# Altium schematic sheet Sheet1.SchDoc
size A3; SheetNumber: 1; SheetTotal: 1
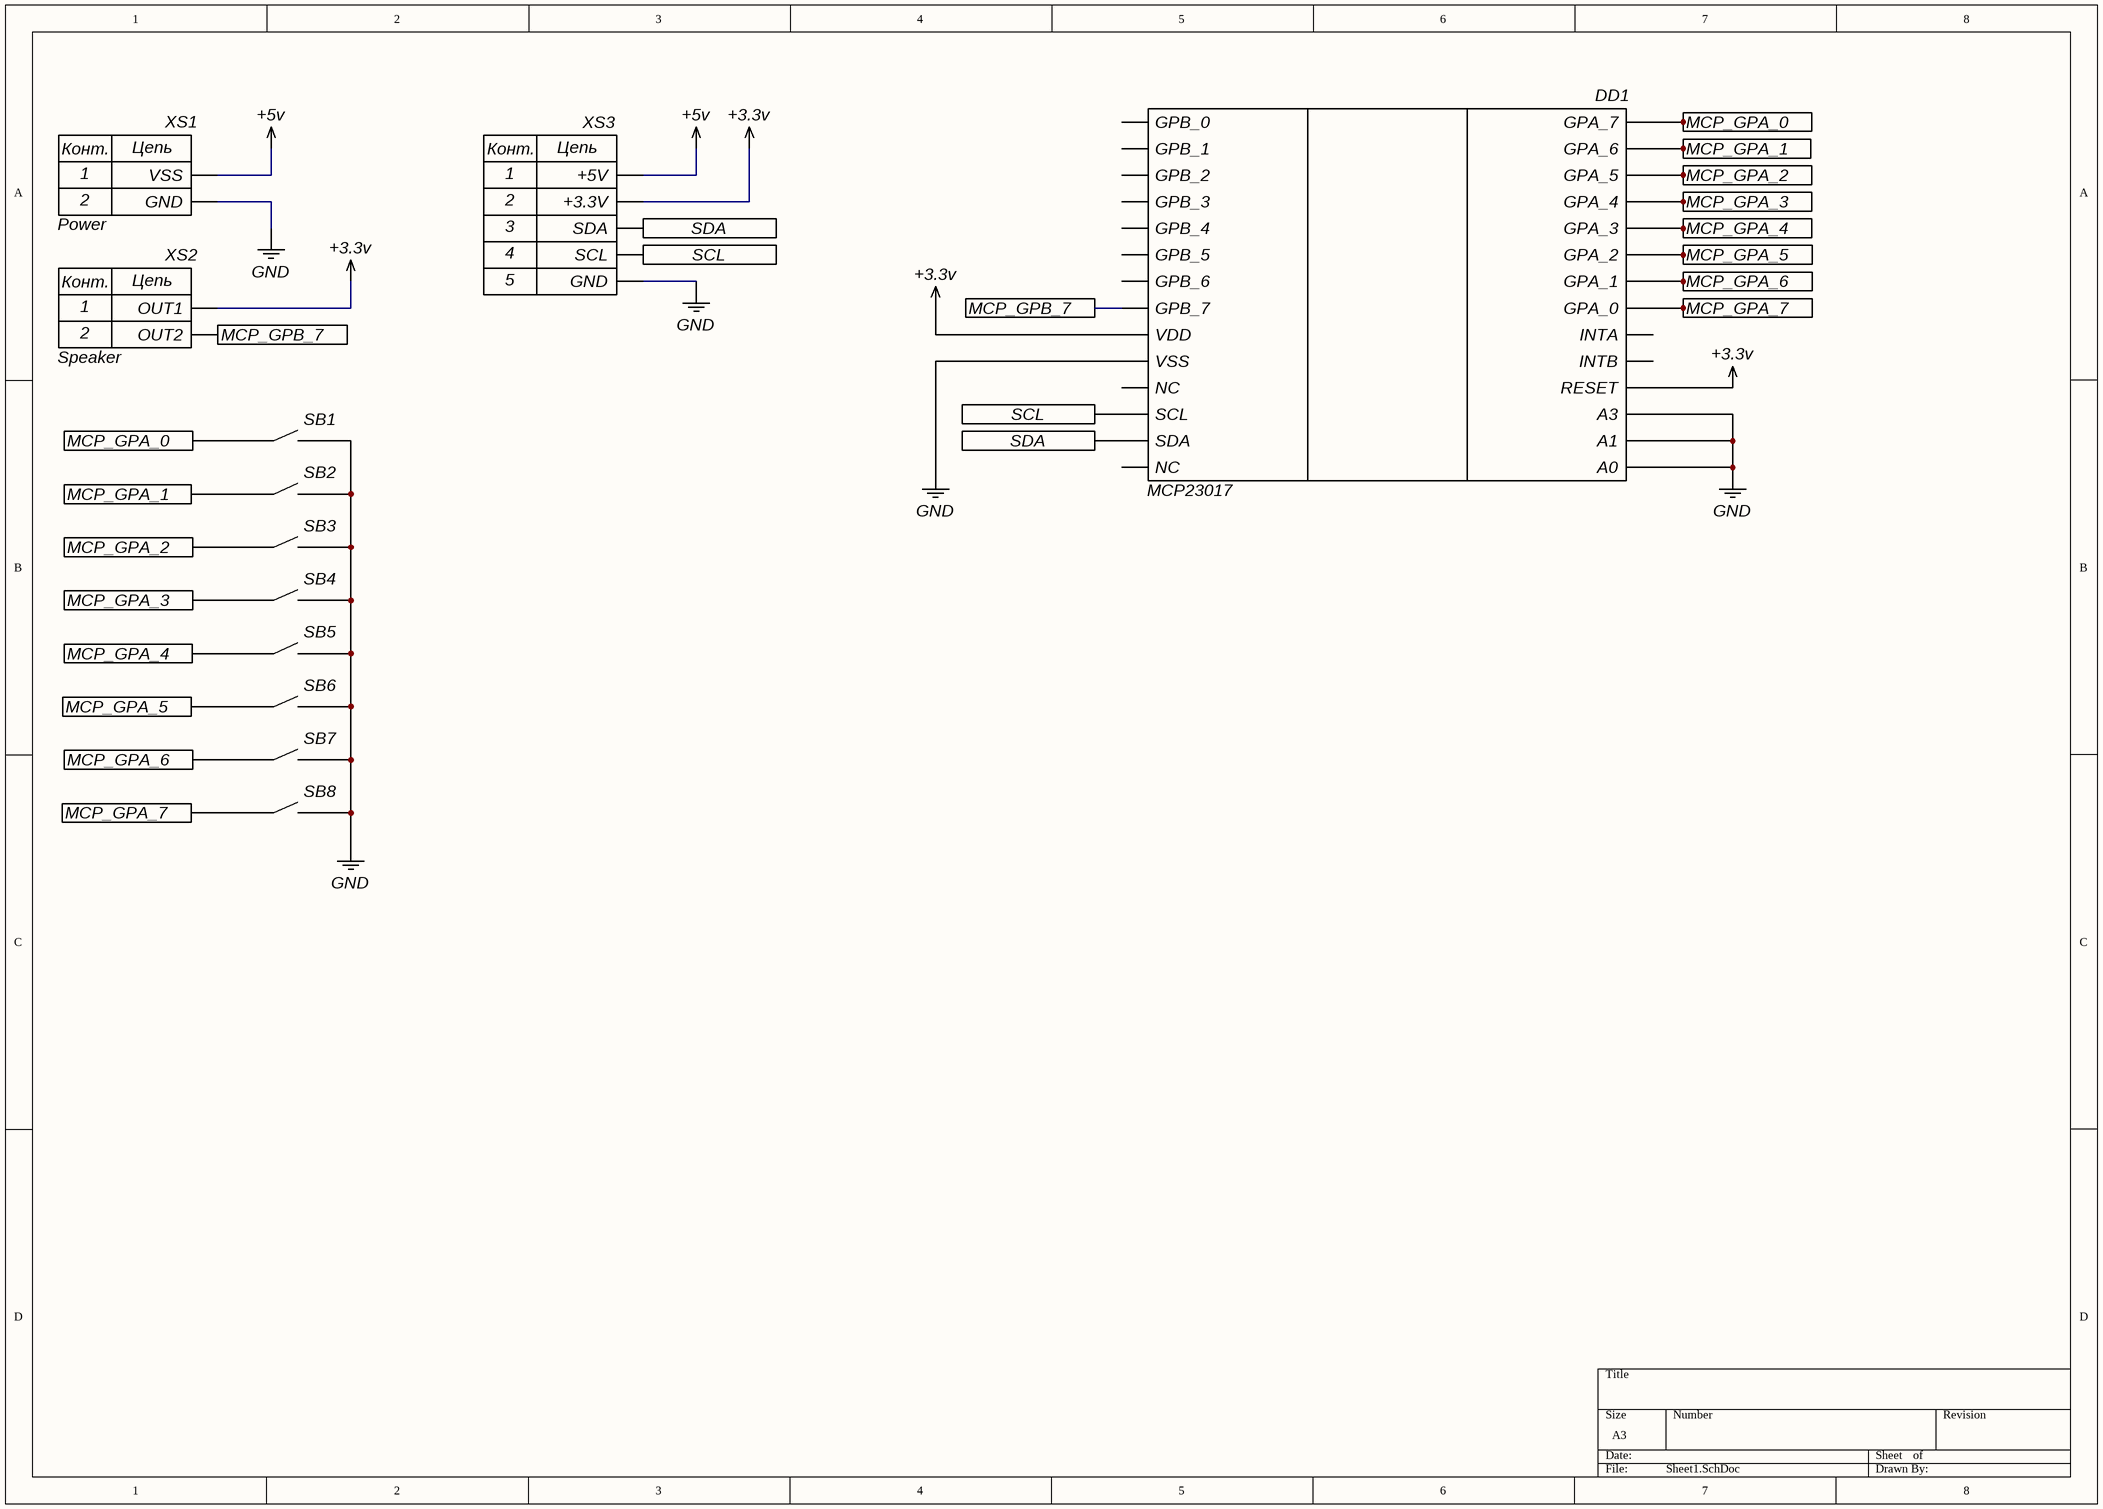
[diagram p0: Sheet1.SchDoc]

## Parts
DD1  MCP23017  [DIP28]
SB1  button  [button]  (value not drawn)
SB2  button  [button]  (value not drawn)
SB3  button  [button]  (value not drawn)
SB4  button  [button]  (value not drawn)
SB5  button  [button]  (value not drawn)
SB6  button  [button]  (value not drawn)
SB7  button  [button]  (value not drawn)
SB8  button  [button]  (value not drawn)
XS1  Power  [Power]
XS2  Speaker  [button]
XS3  I2C  [PINOUTX5]  (value not drawn)

## Ports
MCP_GPA_0 (see Sheet1[1B]), MCP_GPA_0 (see Sheet1[7A]), MCP_GPA_1 (see Sheet1[1B]), MCP_GPA_1 (see Sheet1[7A]), MCP_GPA_2 (see Sheet1[1B]), MCP_GPA_2 (see Sheet1[7A]), MCP_GPA_3 (see Sheet1[1B]), MCP_GPA_3 (see Sheet1[7A]), MCP_GPA_4 (see Sheet1[1B]), MCP_GPA_4 (see Sheet1[7A]), MCP_GPA_5 (see Sheet1[1B]), MCP_GPA_5 (see Sheet1[7A]), MCP_GPA_6 (see Sheet1[1C]), MCP_GPA_6 (see Sheet1[7A]), MCP_GPA_7 (see Sheet1[1C]), MCP_GPA_7 (see Sheet1[7A]), MCP_GPB_7 (see Sheet1[1A]), MCP_GPB_7 (see Sheet1[4A]), SCL (see Sheet1[3A]), SCL (see Sheet1[4B]), SDA (see Sheet1[3A]), SDA (see Sheet1[4B])

## Nets
+3.3v: DD1.9(VDD) DD1.18(RESET) XS2.1(OUT1) XS3.2(+3.3V)
+5v: XS1.1(VSS) XS3.1(+5V)
GND: DD1.10(VSS) DD1.15(A0) DD1.16(A1) DD1.17(A3) SB1.2 SB2.2 SB3.2 SB4.2 SB5.2 SB6.2 SB7.2 SB8.2 XS1.2(GND) XS3.5(GND)
MCP_GPA_0: DD1.28(GPA_7) SB1.1 ; port MCP_GPA_0
MCP_GPA_1: DD1.27(GPA_6) SB2.1 ; port MCP_GPA_1
MCP_GPA_2: DD1.26(GPA_5) SB3.1 ; port MCP_GPA_2
MCP_GPA_3: DD1.25(GPA_4) SB4.1 ; port MCP_GPA_3
MCP_GPA_4: DD1.24(GPA_3) SB5.1 ; port MCP_GPA_4
MCP_GPA_5: DD1.23(GPA_2) SB6.1 ; port MCP_GPA_5
MCP_GPA_6: DD1.22(GPA_1) SB7.1 ; port MCP_GPA_6
MCP_GPA_7: DD1.21(GPA_0) SB8.1 ; port MCP_GPA_7
MCP_GPB_7: DD1.8(GPB_7) XS2.2(OUT2) ; port MCP_GPB_7
SCL: DD1.12(SCL) XS3.4(SCL) ; port SCL
SDA: DD1.13(SDA) XS3.3(SDA) ; port SDA

Not connected (* = marked no-connect by the designer): DD1 1(GPB_0) 2(GPB_1) 3(GPB_2) 4(GPB_3) 5(GPB_4) 6(GPB_5) 7(GPB_6) 11(NC) 14(NC) 19(INTB) 20(INTA)

## Notes on the sheet
- (in symbol I2C) Конт.; Цепь
- (in symbol pinOutX2) Цепь; Конт.
- (in symbol Power) Конт.; Цепь

## Library data of the parts
XS2 = pinOutX2